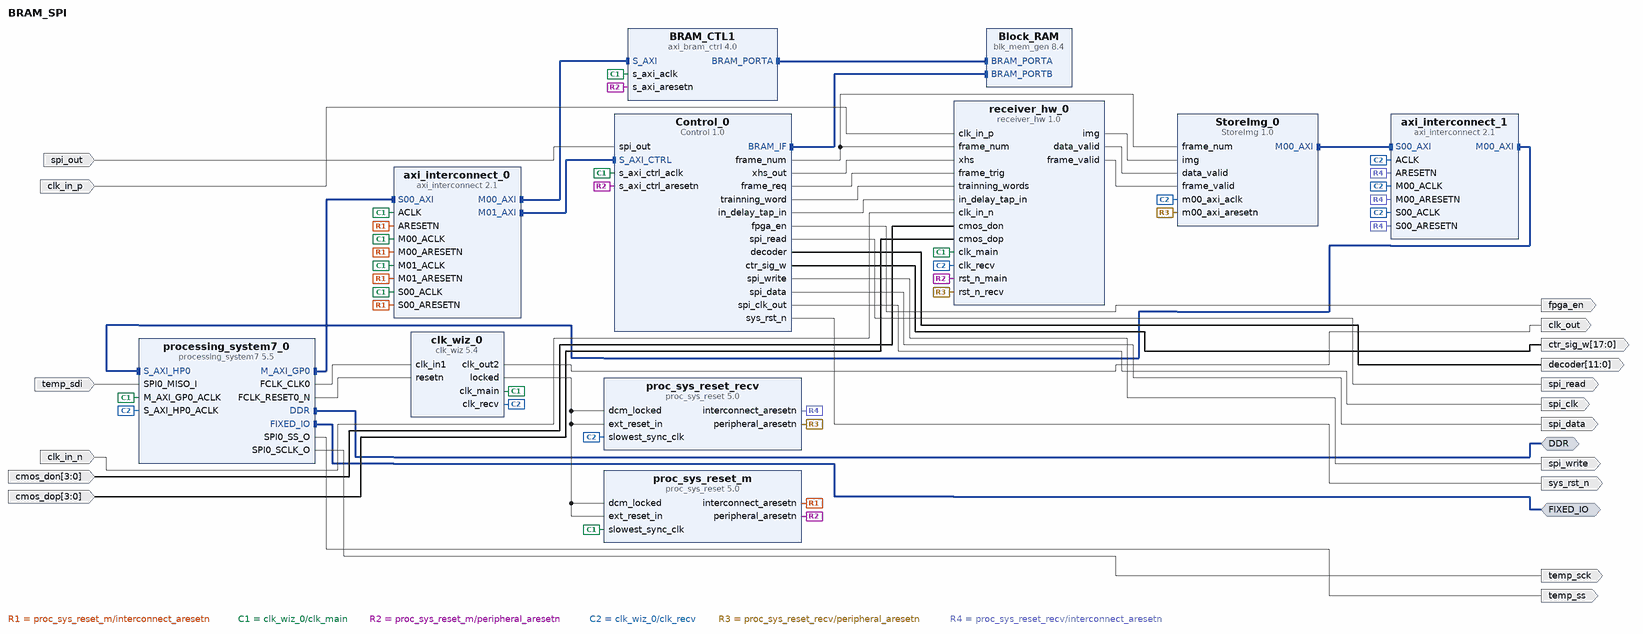
[diagram p0: block diagram of the top level]
# Vivado block design BRAM_SPI, xc7z035ffg676-2, Vivado 2017.4
create_bd_design BRAM_SPI

create_bd_intf_port -mode Master -vlnv xilinx.com:interface:ddrx_rtl:1.0 DDR
create_bd_intf_port -mode Master -vlnv xilinx.com:display_processing_system7:fixedio_rtl:1.0 FIXED_IO
create_bd_port -dir O -type clk clk_out
create_bd_port -dir I temp_sdi
create_bd_port -dir O temp_ss
create_bd_port -dir O temp_sck
create_bd_port -dir O fpga_en
create_bd_port -dir O spi_read
create_bd_port -dir O spi_write
create_bd_port -dir O spi_data
create_bd_port -dir O -type clk spi_clk
create_bd_port -dir O -type rst sys_rst_n
create_bd_port -dir O -from 11 -to 0 decoder
create_bd_port -dir O -from 17 -to 0 ctr_sig_w
create_bd_port -dir I spi_out
create_bd_port -dir I -type clk clk_in_p
create_bd_port -dir I -type clk clk_in_n
create_bd_port -dir I -from 3 -to 0 -type data cmos_don
create_bd_port -dir I -from 3 -to 0 -type data cmos_dop

create_bd_cell -type ip -vlnv xilinx.com:ip:processing_system7:5.5 processing_system7_0
set_property -dict [list \
  CONFIG.PCW_SDIO_PERIPHERAL_FREQMHZ 100 \
  CONFIG.PCW_UART_PERIPHERAL_FREQMHZ 100 \
  CONFIG.PCW_FPGA0_PERIPHERAL_FREQMHZ 100 \
  CONFIG.PCW_USE_S_AXI_HP0 1 \
  CONFIG.PCW_PRESET_BANK1_VOLTAGE {LVCMOS 1.8V} \
  CONFIG.PCW_UIPARAM_DDR_PARTNO {MT41K256M16 RE-125} \
  CONFIG.PCW_QSPI_PERIPHERAL_ENABLE 1 \
  CONFIG.PCW_QSPI_QSPI_IO {MIO 1 .. 6} \
  CONFIG.PCW_QSPI_GRP_SINGLE_SS_ENABLE 1 \
  CONFIG.PCW_QSPI_GRP_SINGLE_SS_IO {MIO 1 .. 6} \
  CONFIG.PCW_SINGLE_QSPI_DATA_MODE x4 \
  CONFIG.PCW_QSPI_GRP_FBCLK_ENABLE 1 \
  CONFIG.PCW_QSPI_GRP_FBCLK_IO {MIO 8} \
  CONFIG.PCW_ENET0_PERIPHERAL_ENABLE 1 \
  CONFIG.PCW_ENET0_ENET0_IO {MIO 16 .. 27} \
  CONFIG.PCW_ENET0_GRP_MDIO_ENABLE 1 \
  CONFIG.PCW_ENET0_GRP_MDIO_IO {MIO 52 .. 53} \
  CONFIG.PCW_SD0_PERIPHERAL_ENABLE 1 \
  CONFIG.PCW_SD0_SD0_IO {MIO 40 .. 45} \
  CONFIG.PCW_SD0_GRP_CD_ENABLE 0 \
  CONFIG.PCW_SD0_GRP_WP_ENABLE 0 \
  CONFIG.PCW_UART1_PERIPHERAL_ENABLE 1 \
  CONFIG.PCW_UART1_UART1_IO {MIO 48 .. 49} \
  CONFIG.PCW_SPI0_PERIPHERAL_ENABLE 1 \
  CONFIG.PCW_SPI0_SPI0_IO EMIO \
  CONFIG.PCW_UIPARAM_GENERATE_SUMMARY NONE \
] [get_bd_cells processing_system7_0]
# 135 more settings of processing_system7_0 are not shown: defaults, MIO pin electricals, DDR timing, and values the tool derives
create_bd_cell -type ip -vlnv xilinx.com:ip:axi_bram_ctrl:4.0 BRAM_CTL1
set_property -dict {CONFIG.PROTOCOL AXI4LITE CONFIG.SINGLE_PORT_BRAM 1 CONFIG.USE_ECC 0} [get_bd_cells BRAM_CTL1]
create_bd_cell -type ip -vlnv xilinx.com:ip:blk_mem_gen:8.4 Block_RAM
set_property -dict [list \
  CONFIG.Memory_Type True_Dual_Port_RAM \
  CONFIG.Enable_32bit_Address true \
  CONFIG.Assume_Synchronous_Clk false \
  CONFIG.Write_Width_A 32 \
  CONFIG.Read_Width_A 32 \
  CONFIG.Write_Width_B 32 \
  CONFIG.Read_Width_B 32 \
  CONFIG.Enable_B Use_ENB_Pin \
  CONFIG.Register_PortA_Output_of_Memory_Primitives false \
  CONFIG.Use_RSTA_Pin true \
  CONFIG.Use_RSTB_Pin true \
  CONFIG.Port_A_Write_Rate 50 \
  CONFIG.Port_B_Clock 100 \
  CONFIG.Port_B_Write_Rate 50 \
  CONFIG.Port_B_Enable_Rate 100 \
  CONFIG.use_bram_block BRAM_Controller \
  CONFIG.EN_SAFETY_CKT false \
] [get_bd_cells Block_RAM]
create_bd_cell -type ip -vlnv xilinx.com:ip:clk_wiz:5.4 clk_wiz_0
set_property -dict [list \
  CONFIG.PRIMITIVE PLL \
  CONFIG.CLKOUT2_USED true \
  CONFIG.CLKOUT3_USED true \
  CONFIG.CLKOUT4_USED false \
  CONFIG.NUM_OUT_CLKS 3 \
  CONFIG.CLK_OUT1_PORT clk_main \
  CONFIG.CLK_OUT3_PORT clk_recv \
  CONFIG.CLK_OUT4_PORT clk_debug \
  CONFIG.CLKOUT1_REQUESTED_OUT_FREQ 10 \
  CONFIG.CLKOUT2_REQUESTED_OUT_FREQ 120 \
  CONFIG.CLKOUT3_REQUESTED_OUT_FREQ 40 \
  CONFIG.CLKOUT4_REQUESTED_OUT_FREQ 180 \
  CONFIG.PRIM_SOURCE Global_buffer \
  CONFIG.CLKOUT1_DRIVES BUFG \
  CONFIG.CLKOUT2_DRIVES BUFG \
  CONFIG.CLKOUT3_DRIVES BUFG \
  CONFIG.CLKOUT4_DRIVES BUFG \
  CONFIG.CLKOUT5_DRIVES BUFG \
  CONFIG.CLKOUT6_DRIVES BUFG \
  CONFIG.CLKOUT7_DRIVES BUFG \
  CONFIG.USE_LOCKED true \
  CONFIG.USE_CLKFB_STOPPED false \
  CONFIG.RESET_PORT resetn \
  CONFIG.MMCM_DIVCLK_DIVIDE 5 \
  CONFIG.MMCM_CLKFBOUT_MULT_F 42 \
  CONFIG.MMCM_CLKIN1_PERIOD 10.000 \
  CONFIG.MMCM_CLKIN2_PERIOD 10.000 \
  CONFIG.MMCM_COMPENSATION ZHOLD \
  CONFIG.MMCM_CLKOUT0_DIVIDE_F 84 \
  CONFIG.MMCM_CLKOUT1_DIVIDE 7 \
  CONFIG.MMCM_CLKOUT2_DIVIDE 21 \
  CONFIG.MMCM_CLKOUT3_DIVIDE 1 \
  CONFIG.RESET_TYPE ACTIVE_LOW \
  CONFIG.CLKOUT1_JITTER 433.844 \
  CONFIG.CLKOUT1_PHASE_ERROR 310.955 \
  CONFIG.CLKOUT2_JITTER 279.155 \
  CONFIG.CLKOUT2_PHASE_ERROR 310.955 \
  CONFIG.CLKOUT3_JITTER 338.471 \
  CONFIG.CLKOUT3_PHASE_ERROR 310.955 \
  CONFIG.CLKOUT4_JITTER 206.401 \
  CONFIG.CLKOUT4_PHASE_ERROR 300.991 \
] [get_bd_cells clk_wiz_0]
create_bd_cell -type ip -vlnv xilinx.com:ip:axi_interconnect:2.1 axi_interconnect_0
set_property -dict [list \
  CONFIG.NUM_SI 1 \
  CONFIG.NUM_MI 2 \
  CONFIG.S01_HAS_REGSLICE 0 \
  CONFIG.S00_HAS_DATA_FIFO 0 \
  CONFIG.S01_HAS_DATA_FIFO 0 \
] [get_bd_cells axi_interconnect_0]
create_bd_cell -type ip -vlnv xilinx.com:ip:proc_sys_reset:5.0 proc_sys_reset_m
create_bd_cell -type ip -vlnv xilinx.com:ip:proc_sys_reset:5.0 proc_sys_reset_recv
create_bd_cell -type ip -vlnv xilinx.com:ip:axi_interconnect:2.1 axi_interconnect_1
set_property -dict {CONFIG.NUM_MI 1 CONFIG.S00_HAS_REGSLICE 1 CONFIG.S00_HAS_DATA_FIFO 2} [get_bd_cells axi_interconnect_1]
create_bd_cell -type ip -vlnv xilinx.com:user:Control:1.0 Control_0
create_bd_cell -type ip -vlnv xilinx.com:user:receiver_hw:1.0 receiver_hw_0
create_bd_cell -type ip -vlnv xilinx.com:user:StoreImg:1.0 StoreImg_0

# ---- connections ----

connect_bd_intf_net [get_bd_intf_pins Block_RAM/BRAM_PORTA] [get_bd_intf_pins BRAM_CTL1/BRAM_PORTA]
connect_bd_intf_net [get_bd_intf_pins axi_interconnect_0/M00_AXI] [get_bd_intf_pins BRAM_CTL1/S_AXI]
connect_bd_intf_net [get_bd_intf_pins processing_system7_0/M_AXI_GP0] [get_bd_intf_pins axi_interconnect_0/S00_AXI]
connect_bd_intf_net [get_bd_intf_pins axi_interconnect_1/M00_AXI] [get_bd_intf_pins processing_system7_0/S_AXI_HP0]
connect_bd_intf_net [get_bd_intf_pins StoreImg_0/M00_AXI] [get_bd_intf_pins axi_interconnect_1/S00_AXI]
connect_bd_intf_net [get_bd_intf_pins Control_0/S_AXI_CTRL] [get_bd_intf_pins axi_interconnect_0/M01_AXI]
connect_bd_intf_net [get_bd_intf_pins Block_RAM/BRAM_PORTB] [get_bd_intf_pins Control_0/BRAM_IF]
connect_bd_intf_net [get_bd_intf_ports DDR] [get_bd_intf_pins processing_system7_0/DDR]
connect_bd_intf_net [get_bd_intf_ports FIXED_IO] [get_bd_intf_pins processing_system7_0/FIXED_IO]
connect_bd_net -net rst_ps7_0_50M_interconnect_aresetn [get_bd_pins proc_sys_reset_m/interconnect_aresetn] \
  [get_bd_pins axi_interconnect_0/S00_ARESETN] [get_bd_pins axi_interconnect_0/M01_ARESETN] \
  [get_bd_pins axi_interconnect_0/M00_ARESETN] [get_bd_pins axi_interconnect_0/ARESETN]
connect_bd_net -net clk_wiz_0_clk_out1 [get_bd_pins clk_wiz_0/clk_main] \
  [get_bd_pins BRAM_CTL1/s_axi_aclk] [get_bd_pins processing_system7_0/M_AXI_GP0_ACLK] \
  [get_bd_pins proc_sys_reset_m/slowest_sync_clk] [get_bd_pins Control_0/s_axi_ctrl_aclk] \
  [get_bd_pins receiver_hw_0/clk_main] [get_bd_pins axi_interconnect_0/M00_ACLK] [get_bd_pins axi_interconnect_0/M01_ACLK] \
  [get_bd_pins axi_interconnect_0/ACLK] [get_bd_pins axi_interconnect_0/S00_ACLK]
connect_bd_net [get_bd_pins processing_system7_0/FCLK_CLK0] [get_bd_pins clk_wiz_0/clk_in1]
connect_bd_net [get_bd_pins processing_system7_0/FCLK_RESET0_N] [get_bd_pins clk_wiz_0/resetn]
connect_bd_net [get_bd_pins clk_wiz_0/locked] \
  [get_bd_pins proc_sys_reset_m/ext_reset_in] [get_bd_pins proc_sys_reset_m/dcm_locked] \
  [get_bd_pins proc_sys_reset_recv/ext_reset_in] [get_bd_pins proc_sys_reset_recv/dcm_locked]
connect_bd_net [get_bd_pins proc_sys_reset_m/peripheral_aresetn] \
  [get_bd_pins BRAM_CTL1/s_axi_aresetn] [get_bd_pins Control_0/s_axi_ctrl_aresetn] [get_bd_pins receiver_hw_0/rst_n_main]
connect_bd_net [get_bd_pins clk_wiz_0/clk_out2] [get_bd_ports clk_out]
connect_bd_net [get_bd_pins clk_wiz_0/clk_recv] \
  [get_bd_pins proc_sys_reset_recv/slowest_sync_clk] [get_bd_pins processing_system7_0/S_AXI_HP0_ACLK] \
  [get_bd_pins receiver_hw_0/clk_recv] [get_bd_pins axi_interconnect_1/ACLK] [get_bd_pins axi_interconnect_1/S00_ACLK] \
  [get_bd_pins axi_interconnect_1/M00_ACLK] [get_bd_pins StoreImg_0/m00_axi_aclk]
connect_bd_net -net SPI0_MISO_I_0_1 [get_bd_ports temp_sdi] [get_bd_pins processing_system7_0/SPI0_MISO_I]
connect_bd_net [get_bd_pins processing_system7_0/SPI0_SS_O] [get_bd_ports temp_ss]
connect_bd_net [get_bd_pins processing_system7_0/SPI0_SCLK_O] [get_bd_ports temp_sck]
connect_bd_net [get_bd_pins Control_0/fpga_en] [get_bd_ports fpga_en]
connect_bd_net [get_bd_pins Control_0/spi_read] [get_bd_ports spi_read]
connect_bd_net [get_bd_pins Control_0/spi_write] [get_bd_ports spi_write]
connect_bd_net [get_bd_pins Control_0/spi_data] [get_bd_ports spi_data]
connect_bd_net [get_bd_pins Control_0/spi_clk_out] [get_bd_ports spi_clk]
connect_bd_net [get_bd_pins Control_0/sys_rst_n] [get_bd_ports sys_rst_n]
connect_bd_net [get_bd_pins Control_0/decoder] [get_bd_ports decoder]
connect_bd_net [get_bd_pins Control_0/ctr_sig_w] [get_bd_ports ctr_sig_w]
connect_bd_net [get_bd_pins proc_sys_reset_recv/peripheral_aresetn] [get_bd_pins receiver_hw_0/rst_n_recv] [get_bd_pins StoreImg_0/m00_axi_aresetn]
connect_bd_net -net ARESETN_1 [get_bd_pins proc_sys_reset_recv/interconnect_aresetn] \
  [get_bd_pins axi_interconnect_1/ARESETN] [get_bd_pins axi_interconnect_1/S00_ARESETN] \
  [get_bd_pins axi_interconnect_1/M00_ARESETN]
connect_bd_net [get_bd_ports spi_out] [get_bd_pins Control_0/spi_out]
connect_bd_net [get_bd_ports clk_in_p] [get_bd_pins receiver_hw_0/clk_in_p]
connect_bd_net [get_bd_ports clk_in_n] [get_bd_pins receiver_hw_0/clk_in_n]
connect_bd_net [get_bd_ports cmos_don] [get_bd_pins receiver_hw_0/cmos_don]
connect_bd_net [get_bd_ports cmos_dop] [get_bd_pins receiver_hw_0/cmos_dop]
connect_bd_net [get_bd_pins Control_0/xhs_out] [get_bd_pins receiver_hw_0/xhs]
connect_bd_net [get_bd_pins receiver_hw_0/img] [get_bd_pins StoreImg_0/img]
connect_bd_net [get_bd_pins receiver_hw_0/data_valid] [get_bd_pins StoreImg_0/data_valid]
connect_bd_net [get_bd_pins receiver_hw_0/frame_valid] [get_bd_pins StoreImg_0/frame_valid]
connect_bd_net [get_bd_pins Control_0/frame_req] [get_bd_pins receiver_hw_0/frame_trig]
connect_bd_net [get_bd_pins Control_0/trainning_word] [get_bd_pins receiver_hw_0/trainning_words]
connect_bd_net [get_bd_pins Control_0/in_delay_tap_in] [get_bd_pins receiver_hw_0/in_delay_tap_in]
connect_bd_net [get_bd_pins Control_0/frame_num] [get_bd_pins receiver_hw_0/frame_num] [get_bd_pins StoreImg_0/frame_num]

# ---- address map ----
assign_bd_address -offset 0x40000000 -range 8K -target_address_space [get_bd_addr_spaces processing_system7_0/Data] [get_bd_addr_segs BRAM_CTL1/S_AXI/Mem0]
assign_bd_address -offset 0x43C00000 -range 64K -target_address_space [get_bd_addr_spaces processing_system7_0/Data] [get_bd_addr_segs Control_0/S_AXI_CTRL/S_AXI_CTRL_reg]
assign_bd_address -offset 0x00000000 -range 1G -target_address_space [get_bd_addr_spaces StoreImg_0/M00_AXI] [get_bd_addr_segs processing_system7_0/S_AXI_HP0/HP0_DDR_LOWOCM]

validate_bd_design
save_bd_design
